# EAGLE design Basic_Mic_Preamp_6 (EAGLE 9.5.2)
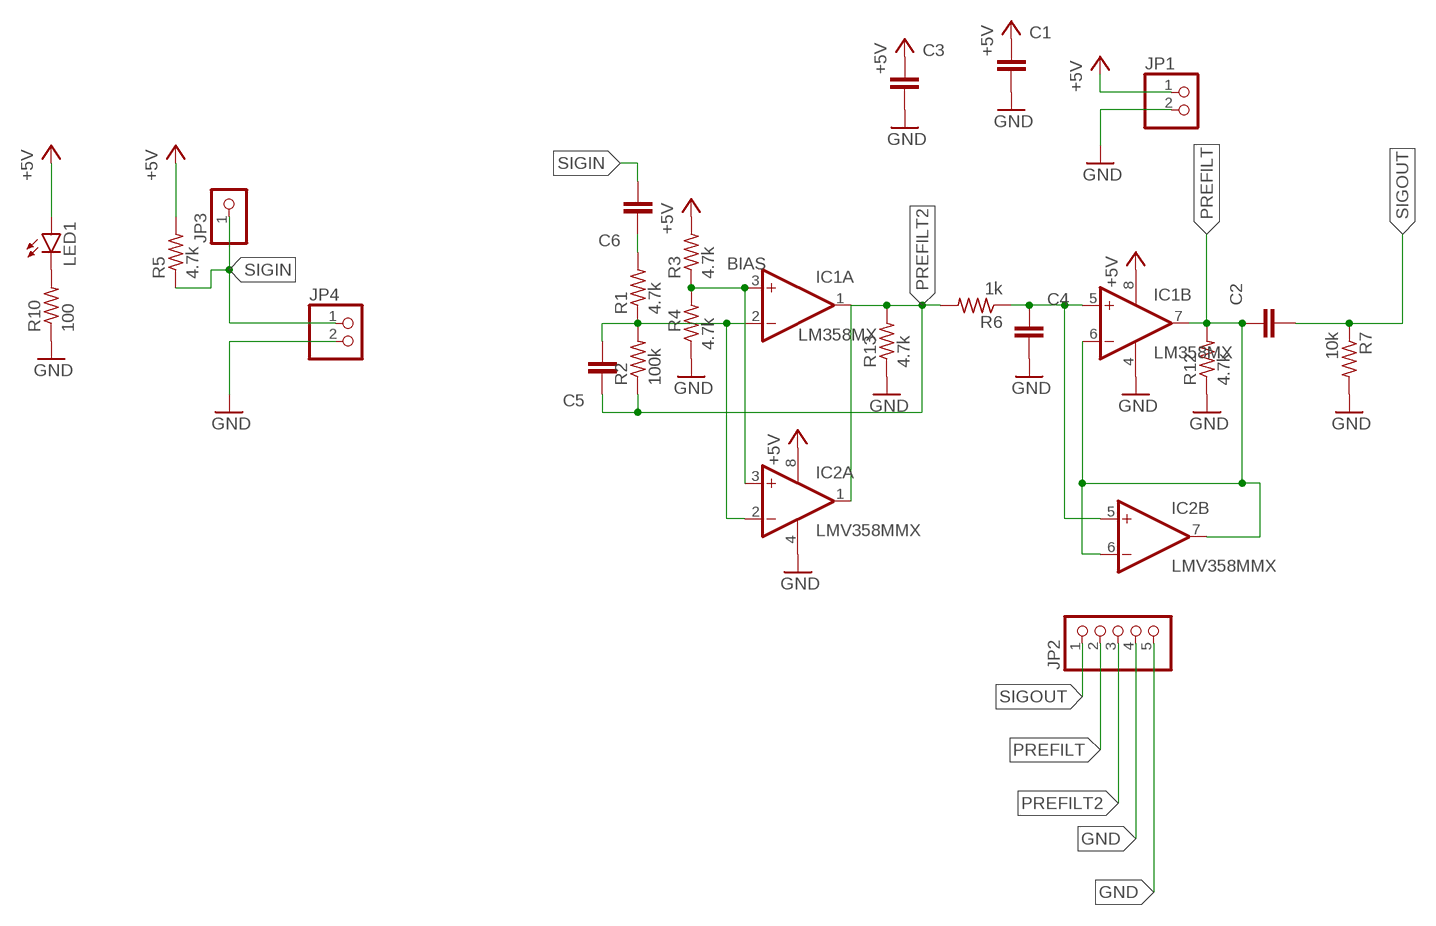
[diagram p0: schematic, sheet 1]

## Parts
C1  10u  C-EUC1206K  [C1206K]
C2  1u  C-EUC1206K  [C1206K]
C3  .01u  C-EUC1206K  [C1206K]
C4  .01u  C-EUC1206K  [C1206K]
C5  500p  C-EUC1206K  [C1206K]
C6  1u  C-EUC1206K  [C1206K]
IC1  LM358MX  [SO08]
IC2  LMV358MMX  [MSOP08]
JP1  PINHD-1X2/90  [1X02/90]
JP2  PINHD-1X5/90  [1X05/90]
JP3  PINHD-1X1  [1X01]
JP4  PINHD-1X2/90  [1X02/90]
LED1  LEDCHIPLED_1206  [CHIPLED_1206]
R1  4.7k  R-US_R1206W  [R1206W]
R2  100k  R-US_R1206W  [R1206W]
R3  4.7k  R-US_R1206W  [R1206W]
R4  4.7k  R-US_R1206W  [R1206W]
R5  4.7k  R-US_R1206W  [R1206W]
R6  1k  R-US_R1206W  [R1206W]
R7  10k  R-US_R1206W  [R1206W]
R10  100  R-US_R1206W  [R1206W]
R12  4.7k  R-US_R1206W  [R1206W]
R13  4.7k  R-US_R1206W  [R1206W]

## Nets
+5V: C1.1 C3.1 IC1.8(P:V+) IC2.8(P:V+) JP1.1 LED1.A R3.2 R5.2
BIAS: IC1.3(A:+IN) IC2.3(A:+IN) R3.1 R4.2
GND: C1.2 C3.2 C4.2 IC1.4(P:V-) IC2.4(P:V-) JP1.2 JP2.4 JP2.5 JP4.2 R4.1 R7.2 R10.1 R12.1 R13.1
N$1: C5.2 IC1.2(A:-IN) IC2.2(A:-IN) R1.1 R2.2
N$2: LED1.C R10.2
N$4: C6.1 R1.2
N$5: C4.1 IC1.5(B:+IN) IC2.5(B:+IN) R6.1
PREFILT: C2.1 IC1.6(B:-IN) IC1.7(B:OUT) IC2.6(B:-IN) IC2.7(B:OUT) JP2.2 R12.2
PREFILT2: C5.1 IC1.1(A:OUT) IC2.1(A:OUT) JP2.3 R2.1 R6.2 R13.2
SIGIN: C6.2 JP3.1 JP4.1 R5.1
SIGOUT: C2.2 JP2.1 R7.1

## Library data of the parts
C1-C6 = Favorite_Parts:C-EU: CAPACITOR, European symbol; SPICEPREFIX: C
IC1 = linear:LM358: OP AMP also LM158; LM258; LM2904 Source: http://cache.national.com/ds/LM/LM158.pdf
IC2 = linear:LMV358?*: Dual General Purpose, Low Voltage, Rail-to-Rail Output Operational Amplifiers Source: http://www.national.com/mpf/LM/LMV321.html http://www.national.com/dt/lmv_qual.pdf
JP1 JP4 = pinhead:PINHD-1X2: PIN HEADER
JP2 = pinhead:PINHD-1X5: PIN HEADER
JP3 = pinhead:PINHD-1X1: PIN HEADER
LED1 = led:LED: LED OSRAM: - CHIPLED LG R971, LG N971, LY N971, LG Q971, LY Q971, LO R971, LY R971 LH N974, LH R974 LS Q976, LO Q976, LY Q976 LO Q996 - Hyper CHIPLED LW Q18S LB Q993, LB Q99A, LB R99A - SideLED LS A670, LO A670, LY A670, LG A670, LP A670 LB A673, LV A673, LT A673, LW A673 LH A674 LY A675 LS A676, LA A676, LO A676, LY A676, LW A676 LS A679, LY A679, LG A679 - Hyper Micro SIDELED® LS Y876, LA Y876, LO Y876, LY Y876 LT Y87S - SmartLED LW L88C, LW L88S LB L89C, LB L89S, LG L890 LS L89K, LO L89K, LY L89K LS L896, LA L896, LO L896, LY L896 - TOPLED LS T670, LO T670, LY T670, LG T670, LP T670 LSG T670, LSP T670, LSY T670, LOP T670, LYG T670 LG T671, LOG T671, LSG T671 LB T673, LV T673, LT T673, LW T673 LH T674 LS T676, LA T676, LO T676, LY T676, LB T676, LH T676, LSB T676, LW T676 LB T67C, LV T67C, LT T67C, LS T67K, LO T67K, LY T67K, LW E67C LS E67B, LA E67B, LO E67B, LY E67B, LB E67C, LV E67C, LT E67C LW T67C LS T679, LY T679, LG T679 LS T770, LO T770, LY T770, LG T770, LP T770 LB T773, LV T773, LT T773, LW T773 LH T774 LS E675, LA E675, LY E675, LS T675 LS T776, LA T776, LO T776, LY T776, LB T776 LHGB T686 LT T68C, LB T68C - Hyper Mini TOPLED® LB M676 - Mini TOPLED Santana® LG M470 LS M47K, LO M47K, LY M47K Source: http://www.osram.convergy.de LUXEON: - LUMILED® LXK2-PW12-R00, LXK2-PW12-S00, LXK2-PW14-U00, LXK2-PW14-V00 LXK2-PM12-R00, LXK2-PM12-S00, LXK2-PM14-U00 LXK2-PE12-Q00, LXK2-PE12-R00, LXK2-PE12-S00, LXK2-PE14-T00, LXK2-PE14-U00 LXK2-PB12-K00, LXK2-PB12-L00, LXK2-PB12-M00, LXK2-PB14-N00, LXK2-PB14-P00, LXK2-PB14-Q00 LXK2-PR12-L00, LXK2-PR12-M00, LXK2-PR14-Q00, LXK2-PR14-R00 LXK2-PD12-Q00, LXK2-PD12-R00, LXK2-PD12-S00 LXK2-PH12-R00, LXK2-PH12-S00 LXK2-PL12-P00, LXK2-PL12-Q00, LXK2-PL12-R00 Source: www.luxeon.com KINGBRIGHT: KA-3528ASYC Source: www.kingbright.com
R1-R7 R10 R12 R13 = rcl:R-US_: RESISTOR, American symbol; SPICEPREFIX: R

## Board
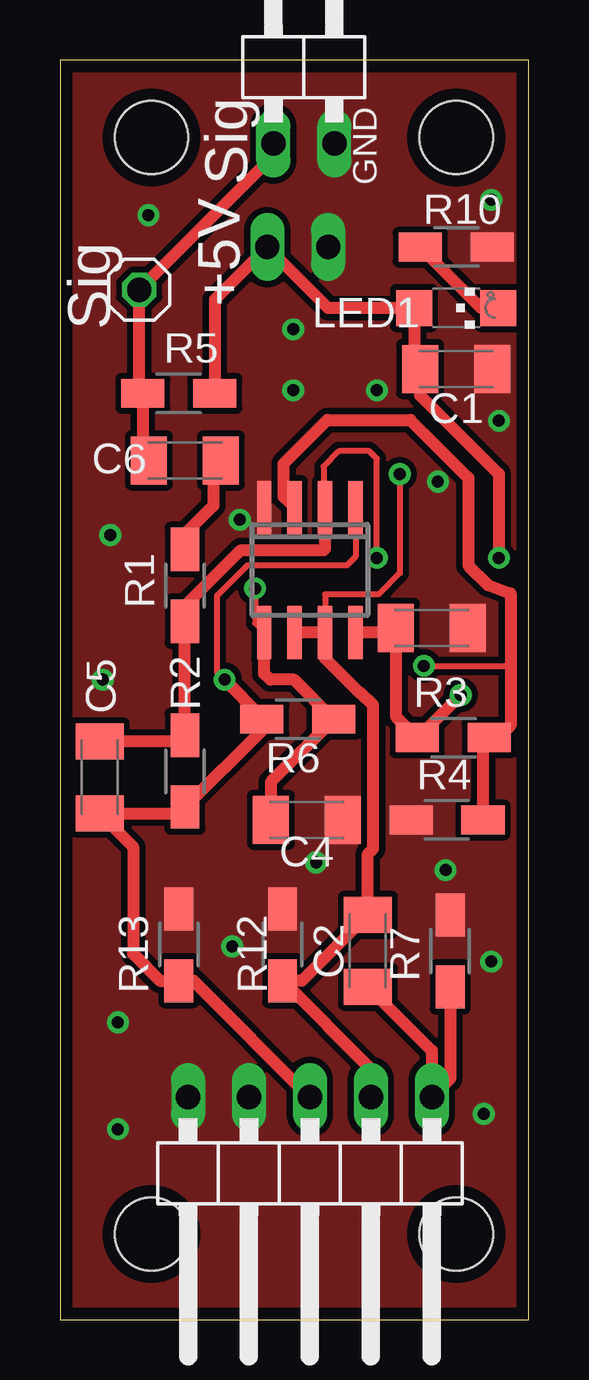
[diagram p1: board, top side]
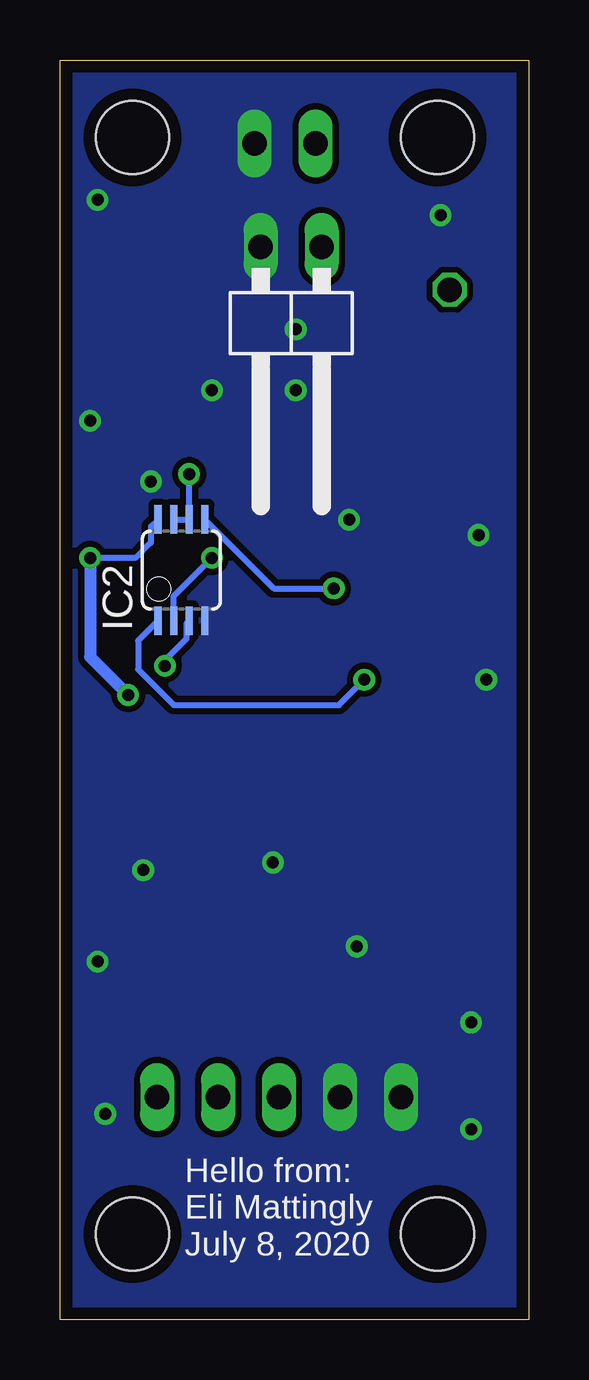
[diagram p2: board, bottom side, seen from below]

Size 19.54 x 52.5 mm. Coordinates in mm from the lower left corner, seen from the top.
Outline: 0,0 19.54,0 19.54,52.5 0,52.5 0,0
Copper layers (1*16): Top 0.035mm / dielectric 1.5mm / Bottom 0.035mm
Design rules "default *": minimum track width 10mil, minimum drill 0.5mm, track to track 10mil, track to pad 10mil, pad to pad 10mil, via to via 10mil, smd to smd 10mil, copper to edge 20mil, drill to drill 6mil, minimum pad ring 8mil, minimum via ring 8mil, stop-mask expansion 4mil, vias tented up to drill 0mil, thermal gap 0mil
Holes 3.05 mm at 3.81,3.56 16.51,3.56 3.81,49.28 16.51,49.28

### Footprints (pad centres in the part's own frame; a part is rotated, then mirrored left to right if it is on the bottom)
C1206K = smd 1.5 x 2: 1 -1.5,0; 2 1.5,0
SO08 = smd 0.6 x 2.2: 1 -1.905,-2.6; 2 -0.635,-2.6; 3 0.635,-2.6; 4 1.905,-2.6; 5 1.905,2.6; 6 0.635,2.6; 7 -0.635,2.6; 8 -1.905,2.6
MSOP08 = smd 0.3 x 1.2: 1 -0.976,-2.113; 2 -0.326,-2.113; 3 0.324,-2.113; 4 0.974,-2.113; 5 0.974,2.112; 6 0.324,2.112; 7 -0.326,2.112; 8 -0.976,2.112
1X02/90 = drill 1.016 long: 1 -1.27,-3.81; 2 1.27,-3.81
1X05/90 = drill 1.016 long: 1 -5.08,-3.81; 2 -2.54,-3.81; 3 0,-3.81; 4 2.54,-3.81; 5 5.08,-3.81
1X01 = drill 1.016 octagon: 1 0,0
CHIPLED_1206 = smd 1.5 x 1.5: A 0,-1.75; C 0,1.75
R1206W = smd 1.8 x 1.2: 1 -1.499,0; 2 1.499,0

### Placement (x,y rotation side)
C1  16.51,39.62 0 top
C2  12.83,15.37 270 top
C3  15.49,28.83 0 top
C4  10.29,20.83 0 top
C5  1.65,22.61 90 top
C6  5.21,35.81 180 top
IC1  10.41,31.24 180 top
IC2  14.48,31.24 0 bottom
JP1  9.91,40.89 180 bottom
JP2  10.41,5.46 180 top
JP3  3.3,42.93 0 top
JP4  10.16,52.83 0 top
LED1  16.51,42.16 270 top
R1  5.21,30.61 90 top
R2  5.21,22.86 90 top
R3  16.38,24.26 180 top
R4  16.13,20.83 0 top
R5  4.95,38.61 0 top
R6  9.91,25.02 180 top
R7  16.26,15.37 90 top
R10  16.51,44.7 180 top
R12  9.27,15.62 270 top
R13  4.95,15.62 270 top

### Tracks (layer width: path | path; a pad name or v marks a point on that pad's centre or on a via)
+5V  (via drill 0.5)
  Top 0.508: R5.2 6.45,42.52 JP1.1 11.18,42.16 LED1.A 14.76,39.87 C1.1 15.01,38.52 18.29,35.24 v18.29,31.75 | IC1.8 13.81,28.64 C3.1 13.99,25.15 R3.2 14.92,24.26 v16.7,26.04
  Bottom 0.254: IC2.8 15.75,33.06 15.75,32.38 16.38,31.75 v18.29,31.75
  Bottom 0.508: v18.29,31.75 18.29,27.62 v16.7,26.04
BIAS  (via drill 0.5)
  Top 0.254: v15.17,27.25 18.72,27.25 18.78,27.3
  Top 0.508: IC1.3 9.32,34.3 9.32,35.67 11.14,37.5 14.6,37.5 17.02,35.08 17.02,31.43 17.84,30.61 18.78,30.27 18.78,27.3 18.78,24.77 18.27,24.26 R3.1 17.63,24 R4.2
  Bottom 0.254: IC2.3 14.27,29.01 14.27,28.37 15.17,27.48 v15.17,27.25
GND  (via drill 0.5)
  other vias: 2.1,32.7 1.78,26.67 9.72,38.73 13.21,38.73 9.72,41.27 17.97,46.67 7.49,33.34 3.68,46.04 7.18,15.56 10.67,19.05 16.07,18.73 2.41,12.38 2.41,7.94 17.65,8.57 17.97,14.92 15.75,34.93 18.29,37.47
  pour Top: -0.51,52.83 23.62,52.83 23.62,-1.02 -0.51,-1.02
  pour Bottom: -0.76,52.32 -0.76,-0.76 0,-1.52 22.35,-1.52 23.37,-0.51 23.37,52.32
N$1  (via drill 0.5)
  Top 0.254: v13.21,31.75 13.21,35.88 12.89,36.2 11.62,36.2 10.99,35.56 10.99,33.91 IC1.2
  Top 0.508: IC1.2 11.05,32.13 10.99,32.07 7.53,32.07 5.21,29.74 R1.1 R2.2 4.95,24.11 C5.2
  Bottom 0.254: IC2.2 14.8,30.15 v13.21,31.75
N$2
  Top 0.508: R10.2 17.55,42.16 LED1.C
N$4
  Top 0.508: C6.1 6.39,35.5 6.39,33.92 5.21,32.74 R1.2
N$5  (via drill 0.5)
  Top 0.254: v8.13,30.48 8.13,29.02 IC1.5
  Top 0.508: IC1.5 8.51,26.92 8.76,26.67 9.75,26.67 R6.1 8.79,22.4 C4.1
  Bottom 0.254: IC2.5 10.63,30.48 v8.13,30.48
PREFILT  (via drill 0.5)
  Top 0.254: v14.16,35.24 14.16,31.12 13.27,30.23 11.05,30.23 IC1.7
  Top 0.508: IC1.6 IC1.7 11.05,27.56 12.48,26.13 12.52,26.13 13.04,25.6 13.04,19.62 12.83,19.4 C2.1 10.08,14.12 R12.2 12.95,10.44 JP2.2
  Bottom 0.254: IC2.7 IC2.6 v14.15,35.24 v14.16,35.24
PREFILT2  (via drill 0.5)
  Top 0.254: IC1.1 12.32,31.81 11.94,31.43 7.81,31.43 6.54,30.16 6.54,26.99 v6.86,26.67
  Top 0.508: v6.86,26.67 8.41,25.12 R6.2 8.41,24.56 R2.1 4.95,21.11 C5.1 3.05,19.71 3.05,15.24 4.17,14.12 R13.2 5.56,14.12 JP2.3
  Bottom 0.254: IC2.1 16.29,28.3 16.29,27.1 14.79,25.61 7.92,25.61 v6.86,26.67
SIGIN
  Top 0.508: JP4.1 8.89,48.51 JP3.1 3.3,38.76 R5.1 3.45,36.07 C6.2
SIGOUT
  Top 0.508: C2.2 15.49,11.2 JP2.1 16.26,10.03 R7.1

### Text on the board
tNames: Sig | GND | +5V | Sig
bNames: Hello from: / Eli Mattingly / July 8, 2020